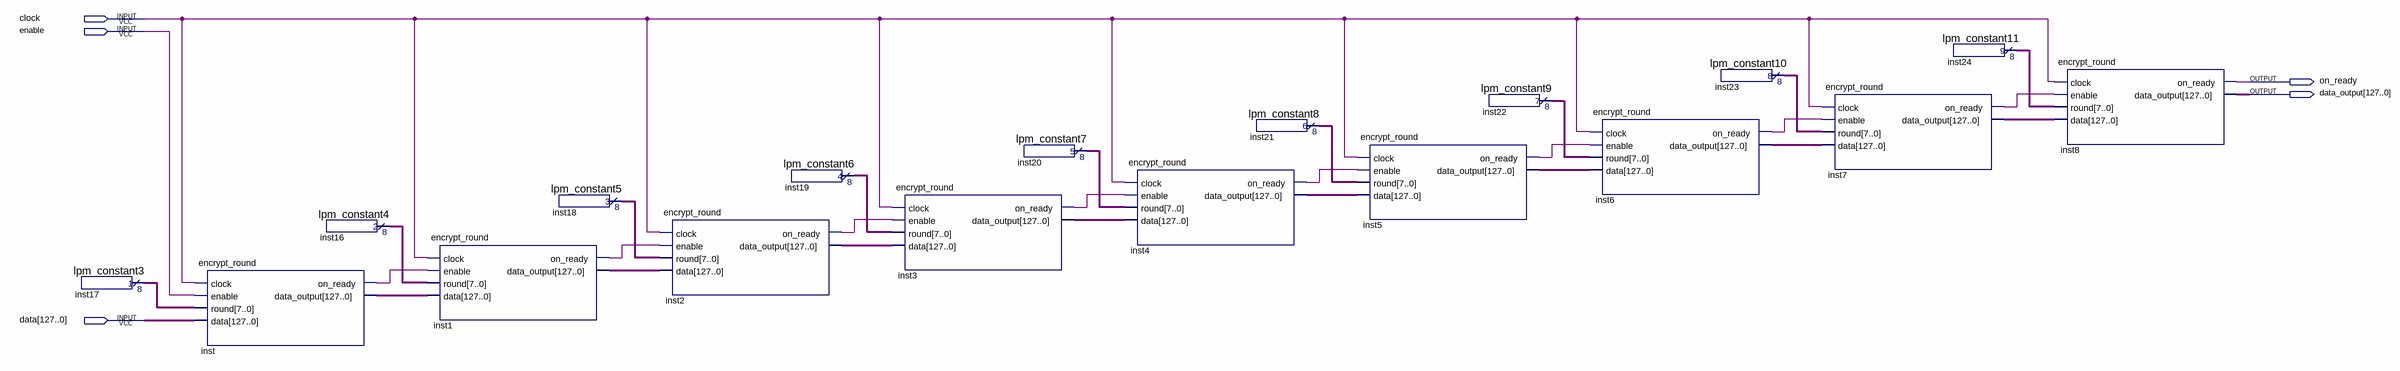
[diagram p0: schematic sheet]
// Quartus schematic 9rounds.bdf as structural Verilog: 18 symbols, 5 pins
module \9rounds  (
  input  clock,
  input  enable,
  input  [127:0] data,
  output on_ready,
  output [127:0] data_output
);

  wire inst1_on_ready, inst2_on_ready, inst3_on_ready, inst4_on_ready, inst5_on_ready, inst6_on_ready,
       inst7_on_ready, inst_on_ready;
  wire [7:0] inst16_result, inst17_result, inst18_result, inst19_result, inst20_result, inst21_result,
       inst22_result, inst23_result, inst24_result;
  wire [127:0] inst1_data_output, inst2_data_output, inst3_data_output, inst4_data_output, inst5_data_output,
       inst6_data_output, inst7_data_output, inst_data_output;

  lpm_constant3 inst17 (.result(inst17_result));
  encrypt_round inst (
    .clock(clock), .enable(enable), .round(inst17_result), .data(data), .on_ready(inst_on_ready),
    .data_output(inst_data_output));
  lpm_constant4 inst16 (.result(inst16_result));
  encrypt_round inst1 (
    .clock(clock), .enable(inst_on_ready), .round(inst16_result), .data(inst_data_output),
    .on_ready(inst1_on_ready), .data_output(inst1_data_output));
  lpm_constant5 inst18 (.result(inst18_result));
  encrypt_round inst2 (
    .clock(clock), .enable(inst1_on_ready), .round(inst18_result), .data(inst1_data_output),
    .on_ready(inst2_on_ready), .data_output(inst2_data_output));
  lpm_constant6 inst19 (.result(inst19_result));
  encrypt_round inst3 (
    .clock(clock), .enable(inst2_on_ready), .round(inst19_result), .data(inst2_data_output),
    .on_ready(inst3_on_ready), .data_output(inst3_data_output));
  lpm_constant7 inst20 (.result(inst20_result));
  encrypt_round inst4 (
    .clock(clock), .enable(inst3_on_ready), .round(inst20_result), .data(inst3_data_output),
    .on_ready(inst4_on_ready), .data_output(inst4_data_output));
  lpm_constant8 inst21 (.result(inst21_result));
  encrypt_round inst5 (
    .clock(clock), .enable(inst4_on_ready), .round(inst21_result), .data(inst4_data_output),
    .on_ready(inst5_on_ready), .data_output(inst5_data_output));
  lpm_constant9 inst22 (.result(inst22_result));
  encrypt_round inst6 (
    .clock(clock), .enable(inst5_on_ready), .round(inst22_result), .data(inst5_data_output),
    .on_ready(inst6_on_ready), .data_output(inst6_data_output));
  lpm_constant10 inst23 (.result(inst23_result));
  encrypt_round inst7 (
    .clock(clock), .enable(inst6_on_ready), .round(inst23_result), .data(inst6_data_output),
    .on_ready(inst7_on_ready), .data_output(inst7_data_output));
  lpm_constant11 inst24 (.result(inst24_result));
  encrypt_round inst8 (
    .clock(clock), .enable(inst7_on_ready), .round(inst24_result), .data(inst7_data_output),
    .on_ready(on_ready), .data_output(data_output));
endmodule
